# EAGLE design sensor_board (EAGLE 9.4.2)
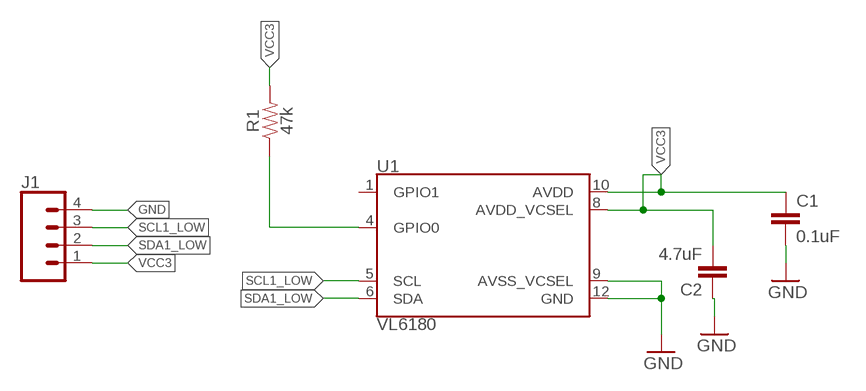
[diagram p0: schematic, sheet 1]

## Parts
C1  0.1uF  0.1UF-0603-25V-(+80/-20%)  [0603]
C2  4.7uF  4.7UF-0603-6.3V-(10%)  [0603]
J1  CONN_04PTH  [1X04]
R1  47k  47KOHM-0603-1/10W-1%  [0603]
U1  VL6180  [VL6180]

## Nets
GND: C1.2 C2.1 J1.4 U1.9(AVSS_VCSEL) U1.12(GND)
N$1: R1.1 U1.4(GPIO0)
SCL1_LOW: J1.3 U1.5(SCL)
SDA1_LOW: J1.2 U1.6(SDA)
VCC3: C1.1 C2.2 J1.1 R1.2 U1.8(AVDD_VCSEL) U1.10(AVDD)
Unconnected: U1.1(GPIO1)

## Library data of the parts
C1 = SparkFun-Capacitors:0.1UF: 0.1µF ceramic capacitors A capacitor is a passive two-terminal electrical component used to store electrical energy temporarily in an electric field.; PROD_ID: CAP-00810
C2 = SparkFun-Capacitors:4.7UF: 4.7µF ceramic capacitors A capacitor is a passive two-terminal electrical component used to store electrical energy temporarily in an electric field.; PROD_ID: CAP-08280
J1 = SparkFun-Connectors:CONN_04: Multi connection point. Often used as Generic Header-pin footprint for 0.1 inch spaced/style header connections On any of the 0.1 inch spaced packages, you can populate with these: Break Away Headers - Straight <https://www.sparkfun.com/products/116> (PRT-00116) Break Away Male Headers - Right Angle <https://www.sparkfun.com/products/553> (PRT-00553) Female Headers <https://www.sparkfun.com/products/115> (PRT-00115) Break Away Headers - Machine Pin <https://www.sparkfun.com/products/117> (PRT-00117) Break Away Female Headers - Swiss Machine Pin <https://www.sparkfun.com/products/743> (PRT-00743) For SCREWTERMINALS and SPRING TERMINALS visit here: Screw Terimnals on SparkFun.com <https://www.sparkfun.com/search/results?term=Screw+Terminals> (5mm/3.5mm/2.54mm spacing) This device is also useful as a general connection point to wire up your design to another part of your project. Our various solder wires solder well into these plated through hole pads. Hook-Up Wire - Assortment (Stranded, 22 AWG) <https://www.sparkfun.com/products/11375> (PRT-11375) Hook-Up Wire - Assortment (Solid Core, 22 AWG) <https://www.sparkfun.com/products/11367> (PRT-11367) View the entire wire category on our website here <https://www.sparkfun.com/categories/141> Special notes: Molex polarized connector foot print use with SKU : PRT-08231 with associated crimp pins and housings. 1MM SMD Version SKU: PRT-10208; PROD_ID: CONN-09696
R1 = SparkFun-Resistors:47KOHM: 47kΩ resistor A resistor is a passive two-terminal electrical component that implements electrical resistance as a circuit element. Resistors act to reduce current flow, and, at the same time, act to lower voltage levels within circuits. - Wikipedia; PROD_ID: RES-07871
U1 = SparkFun-Sensors:VL6180: ST VL6180X Proximity and Ambient Light Sensing (ALS) Module Instead of estimating the distance by measuring the amount of light reflected back from the object (which is significantly influenced by color and surface), the VL6180 precisely measures the time the light takes to travel to the nearest object and reflect back to the sensor (Time-of-Flight). Combining an IR emitter, a range sensor and an ambient light sensor in a three-in-one ready-to-use reflowable package, the VL6180 is easy to integrate and saves the end-product makers the long and costly optical and mechanical design optimizations. Datasheet <https://cdn.sparkfun.com/datasheets/Sensors/Proximity/DM00112632.pdf> SparkFun Products SparkFun ToF Range Finder Breakout - VL6180 <https://www.sparkfun.com/products/12784> (SEN-12784) SparkFun ToF Range Finder Sensor - VL6180 <https://www.sparkfun.com/products/12785> (SEN-12785); PROD_ID: IC-12007

## Board
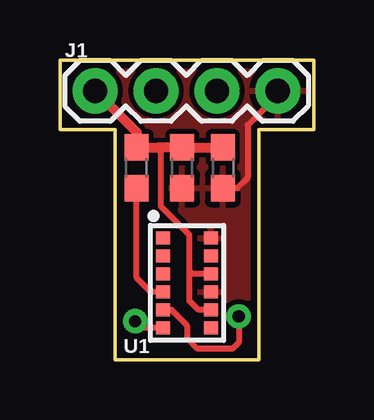
[diagram p1: board, top side]
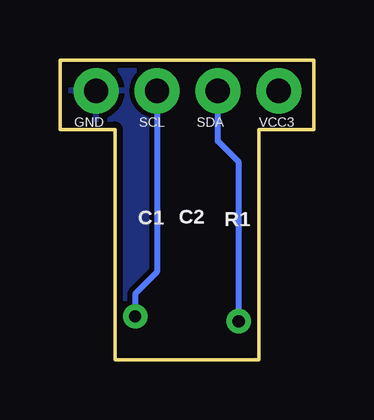
[diagram p2: board, bottom side, seen from below]

Size 10.6 x 12.5 mm. Coordinates in mm from the lower left corner, seen from the top.
Outline: 8.3,0 2.3,0 2.3,9.6 0,9.6 0,12.5 10.6,12.5 10.6,9.6 8.3,9.6 8.3,0
Copper layers (1*16): Top 0.035mm / dielectric 1.5mm / Bottom 0.035mm
Design rules "SparkFun": minimum track width 8mil, minimum drill 20mil, track to track 8mil, track to pad 8mil, pad to pad 8mil, via to via 8mil, smd to smd 8mil, copper to edge 10mil, drill to drill 8mil, minimum pad ring 12mil, minimum via ring 10mil, stop-mask expansion 4mil, vias tented up to drill 25mil, thermal gap 10mil

### Footprints (pad centres in the part's own frame; a part is rotated, then mirrored left to right if it is on the bottom)
0603 = smd 1.1 x 1: 1 -0.85,0; 2 0.85,0
1X04 = drill 1.016 pad 1.88: 1 0,0; 2 2.54,0; 3 5.08,0; 4 7.62,0
VL6180 = smd 0.55 x 0.6: 1 -1.875,-1; 2 -1.125,-1; 3 -0.375,-1; 4 0.375,-1; 5 1.125,-1; 6 1.875,-1; 7 1.875,1; 8 1.125,1; 9 0.375,1; 10 -0.375,1; 11 -1.125,1; 12 -1.875,1

### Placement (x,y rotation side)
C1  6.8,8 270 top
C2  5.1,8 90 top
J1  1.47,11.21 0 top
R1  3.2,8 90 top
U1  5.3,3.2 270 top

### Tracks (layer width: path | path; a pad name or v marks a point on that pad's centre or on a via)
GND
  Top 0.254: J1.4 9.09,11.04 7.84,9.79 7.84,7.6 7.39,7.15 C1.2
  pour Top: -1.2,14.8 12.6,14.8 12.6,-0.9 -1.2,-0.9
  pour Bottom: -1.2,13.7 12.6,13.7 12.6,-0.9 -1.2,-0.9
N$1
  Top 0.254: R1.1 3.2,3.4 3.78,2.83 U1.4
SCL1_LOW  (via drill 0.51)
  Top 0.254: v7.46,1.8 7.46,0.72 7.2,0.46 5.74,0.46 5.3,0.9 5.3,1.44 4.66,2.08 U1.5
  Bottom 0.254: v7.46,1.8 7.46,2.74 6.55,3.65 J1.3
SDA1_LOW  (via drill 0.51)
  Top 0.254: U1.6 3.41,1.33 v3.14,1.6
  Bottom 0.254: J1.2 4.01,9.11 3.14,8.24 v3.14,1.6
VCC3
  Top 0.254: 4.1,8.85 4.2,8.75 4.2,6.4 5.4,5.2 5.4,3.7 | 5.4,3.7 5.4,2.45 5.78,2.08 U1.8 | U1.10 5.52,3.58 5.4,3.7
  Top 0.406: J1.1 3.2,9.48 R1.2 4.1,8.85 C2.2 C1.1

### Text on the board
bPlace: VCC3 | SDA | SCL | GND